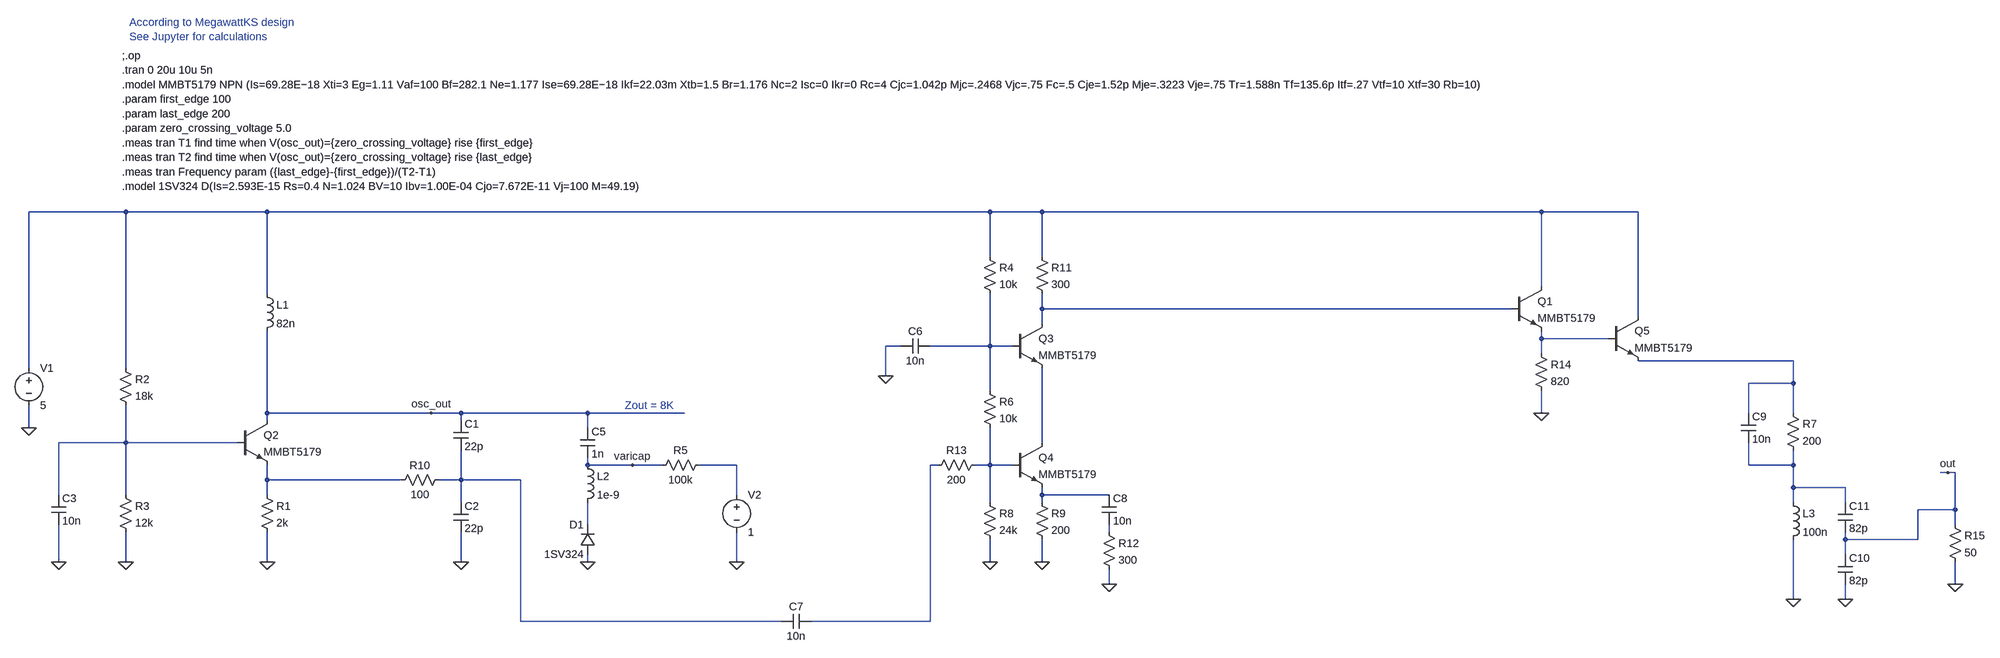
[diagram p0: schematic CB_Colpitts_cascode2.asc]
CB_Colpitts_cascode2.asc, the LTspice schematic file:
Version 4
SHEET 1 4420 1348
WIRE 48 -192 -160 -192
WIRE 352 -192 48 -192
WIRE 1904 -192 352 -192
WIRE 2016 -192 1904 -192
WIRE 3088 -192 2016 -192
WIRE 3296 -192 3088 -192
WIRE 1904 -96 1904 -192
WIRE 2016 -96 2016 -192
WIRE 3088 -32 3088 -192
WIRE 352 -16 352 -192
WIRE 2016 16 2016 -16
WIRE 3024 16 2016 16
WIRE 3296 32 3296 -192
WIRE 2016 48 2016 16
WIRE 3088 80 3088 64
WIRE 3232 80 3088 80
WIRE 1712 96 1680 96
WIRE 1904 96 1904 -16
WIRE 1904 96 1776 96
WIRE 1952 96 1904 96
WIRE 3088 112 3088 80
WIRE 3824 128 3296 128
WIRE -160 144 -160 -192
WIRE 48 144 48 -192
WIRE 1680 160 1680 96
WIRE 3824 176 3824 128
WIRE 3824 176 3728 176
WIRE 1904 192 1904 96
WIRE 352 240 352 64
WIRE 704 240 352 240
WIRE 768 240 704 240
WIRE 1040 240 768 240
WIRE 1248 240 1040 240
WIRE 3088 240 3088 192
WIRE 3728 240 3728 176
WIRE 3824 240 3824 176
WIRE 352 256 352 240
WIRE 768 256 768 240
WIRE -160 272 -160 224
WIRE 1040 272 1040 240
WIRE 48 304 48 224
WIRE 48 304 -96 304
WIRE 288 304 48 304
WIRE 2016 304 2016 144
WIRE 1040 352 1040 336
WIRE 1136 352 1040 352
WIRE 1200 352 1136 352
WIRE 1360 352 1280 352
WIRE 1792 352 1776 352
WIRE 1904 352 1904 272
WIRE 1904 352 1872 352
WIRE 1952 352 1904 352
WIRE 3728 352 3728 304
WIRE 3824 352 3824 320
WIRE 3824 352 3728 352
WIRE 4336 368 4320 368
WIRE 4352 368 4336 368
WIRE 352 384 352 352
WIRE 640 384 352 384
WIRE 768 384 768 320
WIRE 768 384 720 384
WIRE 896 384 768 384
WIRE 3824 400 3824 352
WIRE 3936 400 3824 400
WIRE -96 416 -96 304
WIRE 48 416 48 304
WIRE 352 416 352 384
WIRE 1360 416 1360 352
WIRE 2016 416 2016 400
WIRE 2160 416 2016 416
WIRE 768 432 768 384
WIRE 1904 432 1904 352
WIRE 2016 432 2016 416
WIRE 3824 432 3824 400
WIRE 3936 432 3936 400
WIRE 4352 448 4352 368
WIRE 4352 448 4272 448
WIRE 1040 480 1040 432
WIRE 4352 480 4352 448
WIRE 2160 496 2160 480
WIRE 3936 512 3936 496
WIRE 4272 512 4272 448
WIRE 4272 512 3936 512
WIRE 3936 544 3936 512
WIRE -96 560 -96 480
WIRE 48 560 48 496
WIRE 352 560 352 496
WIRE 768 560 768 496
WIRE 1040 560 1040 544
WIRE 1360 560 1360 496
WIRE 1904 560 1904 512
WIRE 2016 560 2016 512
WIRE 2160 608 2160 576
WIRE 4352 608 4352 560
WIRE 3824 640 3824 512
WIRE 3936 640 3936 608
WIRE 896 688 896 384
WIRE 1456 688 896 688
WIRE 1776 688 1776 352
WIRE 1776 688 1520 688
FLAG -160 272 0
FLAG 48 560 0
FLAG 352 560 0
FLAG 768 560 0
FLAG -96 560 0
FLAG 704 240 osc_out
FLAG 1360 560 0
FLAG 1040 560 0
FLAG 1136 352 varicap
FLAG 1680 160 0
FLAG 1904 560 0
FLAG 2016 560 0
FLAG 2160 608 0
FLAG 4352 608 0
FLAG 3824 640 0
FLAG 4336 368 out
FLAG 3936 640 0
FLAG 3088 240 0
DATAFLAG 144 304 ""
DATAFLAG 928 240 ""
DATAFLAG 464 384 ""
DATAFLAG 1632 688 ""
DATAFLAG 2240 16 ""
DATAFLAG 1824 96 ""
DATAFLAG 2016 208 ""
DATAFLAG 3776 128 ""
DATAFLAG 3136 80 ""
SYMBOL npn 288 256 R0
SYMATTR InstName Q2
SYMATTR Value MMBT5179
SYMBOL res 336 400 R0
SYMATTR InstName R1
SYMATTR Value 2k
SYMBOL res 32 128 R0
SYMATTR InstName R2
SYMATTR Value 18k
SYMBOL res 32 400 R0
SYMATTR InstName R3
SYMATTR Value 12k
SYMBOL voltage -160 128 R0
SYMATTR InstName V1
SYMATTR Value 5
SYMBOL ind 336 -32 R0
SYMATTR InstName L1
SYMATTR Value 82n
SYMATTR SpiceLine Rser=0.01
SYMBOL cap 752 256 R0
SYMATTR InstName C1
SYMATTR Value 22p
SYMBOL cap 752 432 R0
SYMATTR InstName C2
SYMATTR Value 22p
SYMBOL cap -112 416 R0
SYMATTR InstName C3
SYMATTR Value 10n
SYMBOL res 1296 336 R90
WINDOW 0 0 56 VBottom 2
WINDOW 3 32 56 VTop 2
SYMATTR InstName R5
SYMATTR Value 100k
SYMBOL voltage 1360 400 R0
WINDOW 123 0 0 Left 0
WINDOW 39 0 0 Left 0
SYMATTR InstName V2
SYMATTR Value 1
SYMBOL diode 1056 544 R180
WINDOW 0 24 64 Left 2
WINDOW 3 24 0 Left 2
SYMATTR InstName D1
SYMATTR Value 1SV324
SYMBOL ind 1024 336 R0
SYMATTR InstName L2
SYMATTR Value 1e-9
SYMBOL res 736 368 R90
WINDOW 0 0 56 VBottom 2
WINDOW 3 32 56 VTop 2
SYMATTR InstName R10
SYMATTR Value 100
SYMBOL cap 1024 272 R0
SYMATTR InstName C5
SYMATTR Value 1n
SYMBOL npn 3024 -32 R0
SYMATTR InstName Q1
SYMATTR Value MMBT5179
SYMBOL res 3808 224 R0
SYMATTR InstName R7
SYMATTR Value 200
SYMBOL npn 1952 48 R0
SYMATTR InstName Q3
SYMATTR Value MMBT5179
SYMBOL npn 1952 304 R0
SYMATTR InstName Q4
SYMATTR Value MMBT5179
SYMBOL cap 1776 80 R90
WINDOW 0 0 32 VBottom 2
WINDOW 3 32 32 VTop 2
SYMATTR InstName C6
SYMATTR Value 10n
SYMBOL res 1888 -112 R0
SYMATTR InstName R4
SYMATTR Value 10k
SYMBOL res 1888 176 R0
SYMATTR InstName R6
SYMATTR Value 10k
SYMBOL res 1888 416 R0
SYMATTR InstName R8
SYMATTR Value 24k
SYMBOL res 2000 416 R0
SYMATTR InstName R9
SYMATTR Value 200
SYMBOL res 2000 -112 R0
SYMATTR InstName R11
SYMATTR Value 300
SYMBOL cap 1520 672 R90
WINDOW 0 0 32 VBottom 2
WINDOW 3 32 32 VTop 2
SYMATTR InstName C7
SYMATTR Value 10n
SYMBOL cap 2144 416 R0
SYMATTR InstName C8
SYMATTR Value 10n
SYMBOL res 2144 480 R0
SYMATTR InstName R12
SYMATTR Value 300
SYMBOL res 1888 336 R90
WINDOW 0 0 56 VBottom 2
WINDOW 3 32 56 VTop 2
SYMATTR InstName R13
SYMATTR Value 200
SYMBOL res 4336 464 R0
SYMATTR InstName R15
SYMATTR Value 50
SYMBOL cap 3712 240 R0
SYMATTR InstName C9
SYMATTR Value 10n
SYMBOL ind 3808 416 R0
SYMATTR InstName L3
SYMATTR Value 100n
SYMBOL cap 3920 544 R0
SYMATTR InstName C10
SYMATTR Value 82p
SYMBOL cap 3920 432 R0
SYMATTR InstName C11
SYMATTR Value 82p
SYMBOL res 3072 96 R0
SYMATTR InstName R14
SYMATTR Value 820
SYMBOL npn 3232 32 R0
SYMATTR InstName Q5
SYMATTR Value MMBT5179
TEXT 40 -528 Left 2 !;.op\n.tran 0 20u 10u 5n\n.model MMBT5179 NPN (Is=69.28E−18 Xti=3 Eg=1.11 Vaf=100 Bf=282.1 Ne=1.177 Ise=69.28E−18 Ikf=22.03m Xtb=1.5 Br=1.176 Nc=2 Isc=0 Ikr=0 Rc=4 Cjc=1.042p Mjc=.2468 Vjc=.75 Fc=.5 Cje=1.52p Mje=.3223 Vje=.75 Tr=1.588n Tf=135.6p Itf=.27 Vtf=10 Xtf=30 Rb=10)\n.param first_edge 100\n.param last_edge 200\n.param zero_crossing_voltage 5.0\n.meas tran T1 find time when V(osc_out)={zero_crossing_voltage} rise {first_edge}\n.meas tran T2 find time when V(osc_out)={zero_crossing_voltage} rise {last_edge}\n.meas tran Frequency param ({last_edge}-{first_edge})/(T2-T1)\n.model 1SV324 D(Is=2.593E-15 Rs=0.4 N=1.024 BV=10 Ibv=1.00E-04 Cjo=7.672E-11 Vj=100 M=49.19)
TEXT 56 -600 Left 2 ;According to MegawattKS design\nSee Jupyter for calculations
TEXT 1120 224 Left 2 ;Zout = 8K

The netlist it stands for:
* CB_Colpitts_cascode2.asc
Q2 osc_out N006 N012 0 MMBT5179
R1 N012 0 2k
R2 N001 N006 18k
R3 N006 0 12k
V1 N001 0 5
L1 N001 osc_out 82n Rser=0.01
C1 osc_out N013 22p
C2 N013 0 22p
C3 N006 0 10n
R5 N008 varicap 100k
V2 N008 0 1
D1 0 N015 1SV324
L2 varicap N015 1e-9
R10 N013 N012 100
C5 osc_out varicap 1n
Q1 N001 N002 N003 0 MMBT5179
R7 N005 N011 200
Q3 N002 N004 N007 0 MMBT5179
Q4 N007 N010 N014 0 MMBT5179
C6 N004 0 10n
R4 N001 N004 10k
R6 N004 N010 10k
R8 N010 0 24k
R9 N014 0 200
R11 N001 N002 300
C7 N009 N013 10n
C8 N014 N016 10n
R12 N016 0 300
R13 N010 N009 200
R15 out 0 50
C9 N005 N011 10n
L3 N011 0 100n
C10 out 0 82p
C11 N011 out 82p
R14 N003 0 820
Q5 N001 N003 N005 0 MMBT5179
.model D D
.lib standard.dio
.model NPN NPN
.model PNP PNP
.lib standard.bjt
;.op
.tran 0 20u 10u 5n
.model MMBT5179 NPN (Is=69.28E−18 Xti=3 Eg=1.11 Vaf=100 Bf=282.1 Ne=1.177 Ise=69.28E−18 Ikf=22.03m Xtb=1.5 Br=1.176 Nc=2 Isc=0 Ikr=0 Rc=4 Cjc=1.042p Mjc=.2468 Vjc=.75 Fc=.5 Cje=1.52p Mje=.3223 Vje=.75 Tr=1.588n Tf=135.6p Itf=.27 Vtf=10 Xtf=30 Rb=10)
.param first_edge 100
.param last_edge 200
.param zero_crossing_voltage 5.0
.meas tran T1 find time when V(osc_out)={zero_crossing_voltage} rise {first_edge}
.meas tran T2 find time when V(osc_out)={zero_crossing_voltage} rise {last_edge}
.meas tran Frequency param ({last_edge}-{first_edge})/(T2-T1)
.model 1SV324 D(Is=2.593E-15 Rs=0.4 N=1.024 BV=10 Ibv=1.00E-04 Cjo=7.672E-11 Vj=100 M=49.19)
* According to MegawattKS design
* See Jupyter for calculations
* Zout = 8K
.backanno
.end